# Altium project PCB_Project_8.PrjPcb
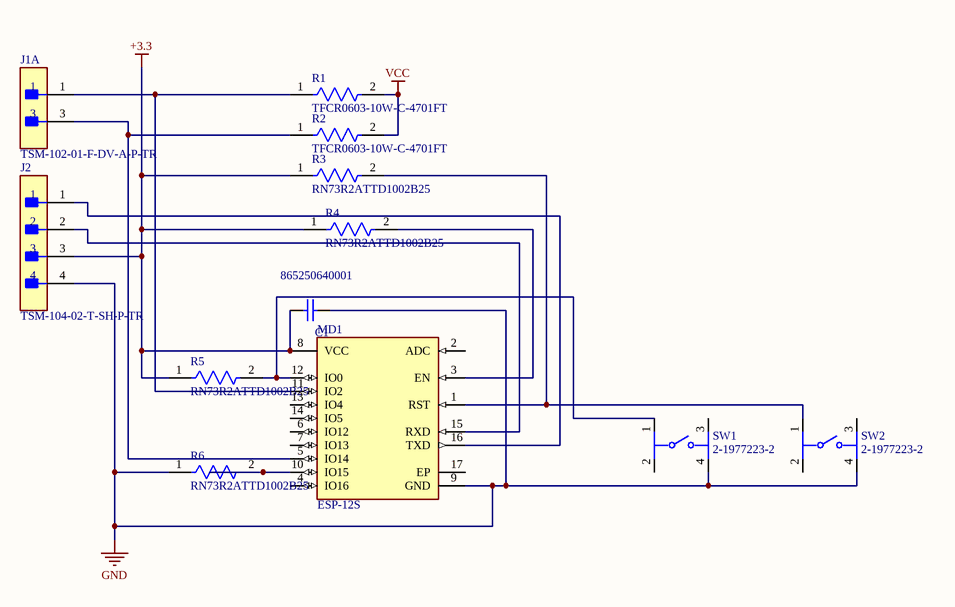
[diagram p0: Sheet1.SchDoc]
1 sheet, 12 parts. Net scope: global (net labels, ports and power ports of the same name join across sheets).
Board file: PCB1.PcbDoc

## Sheet Sheet1.SchDoc
size A; SheetNumber: 1; SheetTotal: 1

### Parts
C1  865250640001  [WCAP-ASNP_D4H5.5]
J1  TSM-102-01-F-DV-A-P-TR  [FP-TSM-102-01-F-DV-A-P-TR-MFG]  (part A of 2)
J2  TSM-104-02-T-SH-P-TR  [FP-TSM-104-02-T-SH-P-TR-MFG]
MD1  ESP-12S  [FP-ESP-12S-MFG]
R1  TFCR0603-10W-C-4701FT  [FP-TFCR0603-IPC_B]
R2  TFCR0603-10W-C-4701FT  [FP-TFCR0603-IPC_B]
R3  RN73R2ATTD1002B25  [FP-RN73R2A-IPC_A]
R4  RN73R2ATTD1002B25  [FP-RN73R2A-IPC_A]
R5  RN73R2ATTD1002B25  [FP-RN73R2A-IPC_A]
R6  RN73R2ATTD1002B25  [FP-RN73R2A-IPC_A]
SW1  2-1977223-2  [FP-2-1977223-2-MFG]
SW2  2-1977223-2  [FP-2-1977223-2-MFG]

### Nets
+3.3: C1.2 J2.3 MD1.8(VCC) R3.1 R4.1 R5.1
GND: C1.1 J2.4 MD1.9(GND) R6.1 SW1.4 SW2.4
VCC: R1.2 R2.2
NetJ1_1: J1.1 MD1.11(IO2) R1.1
NetJ1_3: J1.3 MD1.5(IO14) R2.1
NetJ2_1: J2.1 MD1.16(TXD)
NetJ2_2: J2.2 MD1.15(RXD)
NetMD1_1: MD1.1(RST) R3.2 SW2.1
NetMD1_3: MD1.3(EN) R4.2
NetMD1_10: MD1.10(IO15) R6.2
NetMD1_12: MD1.12(IO0) R5.2 SW1.1

Not connected (* = marked no-connect by the designer): MD1 2(ADC) 4(IO16) 6(IO12) 7(IO13) 13(IO4) 14(IO5) 17(EP); SW1 2 3; SW2 2 3

### Library data of the parts
C1 = CMP-03913-53758718-2: WCAP-ASNP Aluminum Electrolytic Capacitors; Capacitance: 100nF; Life (Hours): 2000hours; Insulation Resistance: 16.6667MΩ; Polarity: Polar; Impedance: 20.6814Ω; Leakage Current: 10µA; Voltage Rating (DC): 50V; Tolerance: 20%; Ripple Current (AC): 1mA; Case/Package: Radial; REACH SVHC: Unknown; Length: 5.5mm; Mount: Surface Mount; RoHS: Compliant; Max Operating Temperature: 85°C; Width: 4.3mm; Ripple Current: 1mA; Diameter: 4mm; Height: 5.5mm; Min Operating Temperature: -40°C; Voltage Rating: 50V; Height - Seated (Max): 5.5118mm
J1 = CMP-00575-51787786-1: TSM-102-01-F-DV-A-P-TR .100" Surface Mount Terminal Strip Rohs Compliant: Yes; Manufacturer Lifecycle Status: PRODUCTION; Number of Contacts: 4; Lead Free: Lead Free; Packaging: Tape and Reel; Number of Rows: 2; Height: 10.16mm; Lifecycle Status: Production; Min Operating Temperature: -55°C; Contact Material: Gold, Nickel; RoHS: Compliant; Max Operating Temperature: 125°C; NexarPartId: 51787786
J2 = CMP-02766-000097-1: CONN HEADER SMD R/A 4POS 2.54MM; Max Voltage Rating (AC): 475V; Gender: Male; Max Current Rating: 7A; Number of Contacts: 4; Contact Material: Bronze; Depth: 13.46mm; Termination: Solder; Radiation Hardening: No; Orientation: Right Angle; Lead Free: Lead Free; Packaging: Tape and Reel; Pitch: 2.54mm; Length: 10.16mm; Housing Color: Black; Number of Rows: 1; Min Operating Temperature: -55°C; Contact Plating: Tin; Max Operating Temperature: 105°C; Housing Material: Polymer
MD1 = CMP-204316-000002-1: RX TXRX MOD WIFI PCB TRACE SMD; Interface: I2C; Sensitivity: -90dBm; Data Rate: 54Mbps; Frequency: 2.484GHz; Series: -
R1 R2 = CMP-250906-287647-1: RES Thin Film,  4.7kΩ, 1%, 0.1W, 50ppm/°C, 0603
R3-R6 = CMP-04015-052084-1: RES 10K OHM 0.1% 1/8W 0805
SW1 SW2 = CMP-03407-000026-1: SWITCH TACTILE SPST-NO 0.05A 24V; RoHS Compliant: Yes